# Altium schematic sheet LED_Adapter (In Konflikt stehende Kopie von Josua Schmid 2012-06-01).SchDoc
size A4; Organization: LAN Verein Berg; Address1: co Jürg Horisbeger; Address2: Andhauserstr.13; Address3: 8572 Berg SWITZERLAND; Address4: jhorisberger@gmx.ch
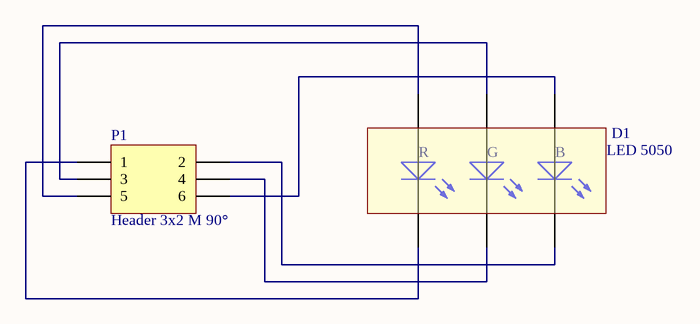
[diagram p0: LED_Adapter (In Konflikt stehende Kopie von Josua Schmid 2012-06-01).SchDoc]

## Parts
D1  LED 5050  [PLCC6]
P1  Header 3x2 M 90°  [Pin Header 3x2 M 90°]

## Nets
NetD1_1: D1.1(K_R) P1.1
NetD1_2: D1.2(A_R) P1.5
NetD1_3: D1.3(K_G) P1.4
NetD1_4: D1.4(A_G) P1.3
NetD1_5: D1.5(K_B) P1.2
NetD1_6: D1.6(A_B) P1.6

## Notes on the sheet
- Title
- Size:
- Date:
- A4
- Number:
- Time:
- Revision:
- Sheet
- of
- File:
- (in symbol LED RGB 5050) R; G; B

## Library data of the parts
D1 = LED RGB 5050: SMD PLCC-6 20mA 5050
P1 = Header 3x2 M 90°: Header, 6-Pin, Male 90°